# EasyEDA Pro project ProPrj_辉光管时钟V1.0_2025-10-09.epro, schematic 驱动+控制部分

## Sheets
1 驱动: Create Date: 2024-01-20; Page Name: 驱动; Project Name: 辉光管时钟成品; Schematic Name: 驱动+控制部分; Update Date: 2024-01-22; Company: 嘉立创EDA; Page Size: A2; Version: V1.0
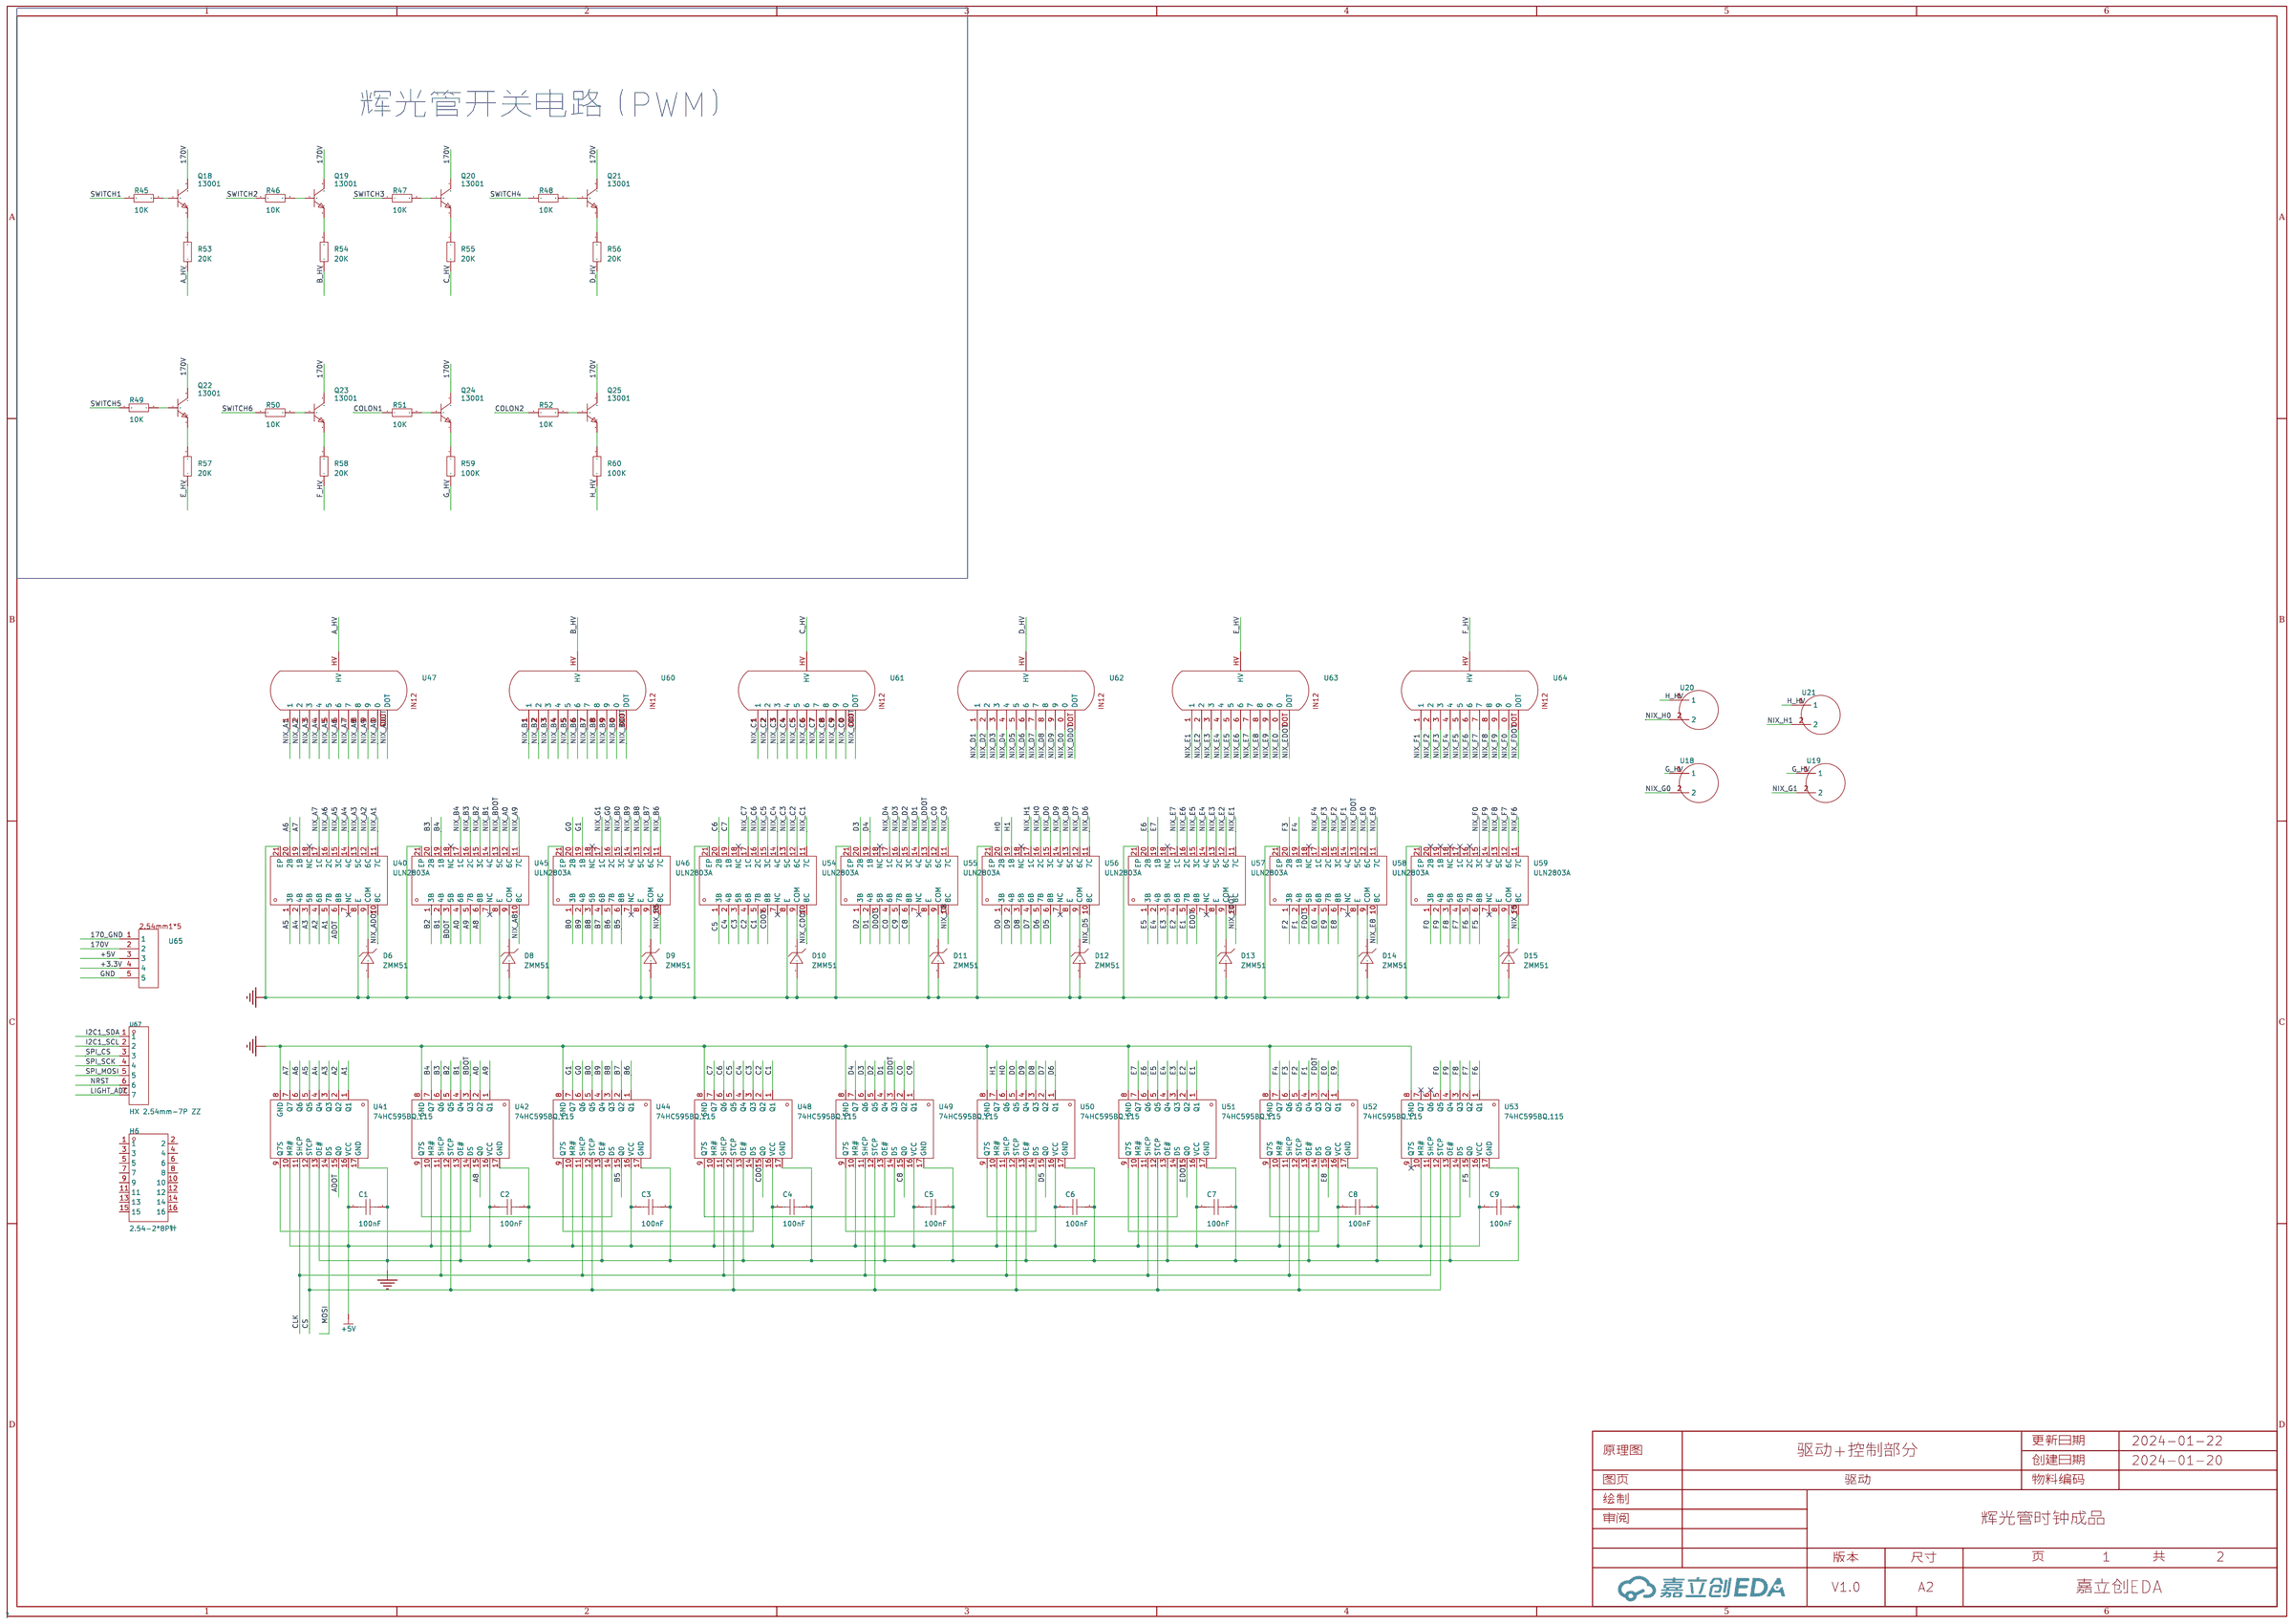
[diagram p4: 驱动]
2 控制: Create Date: 2024-01-22; Page Name: 控制.驱动+控制部分; Page Size: A4
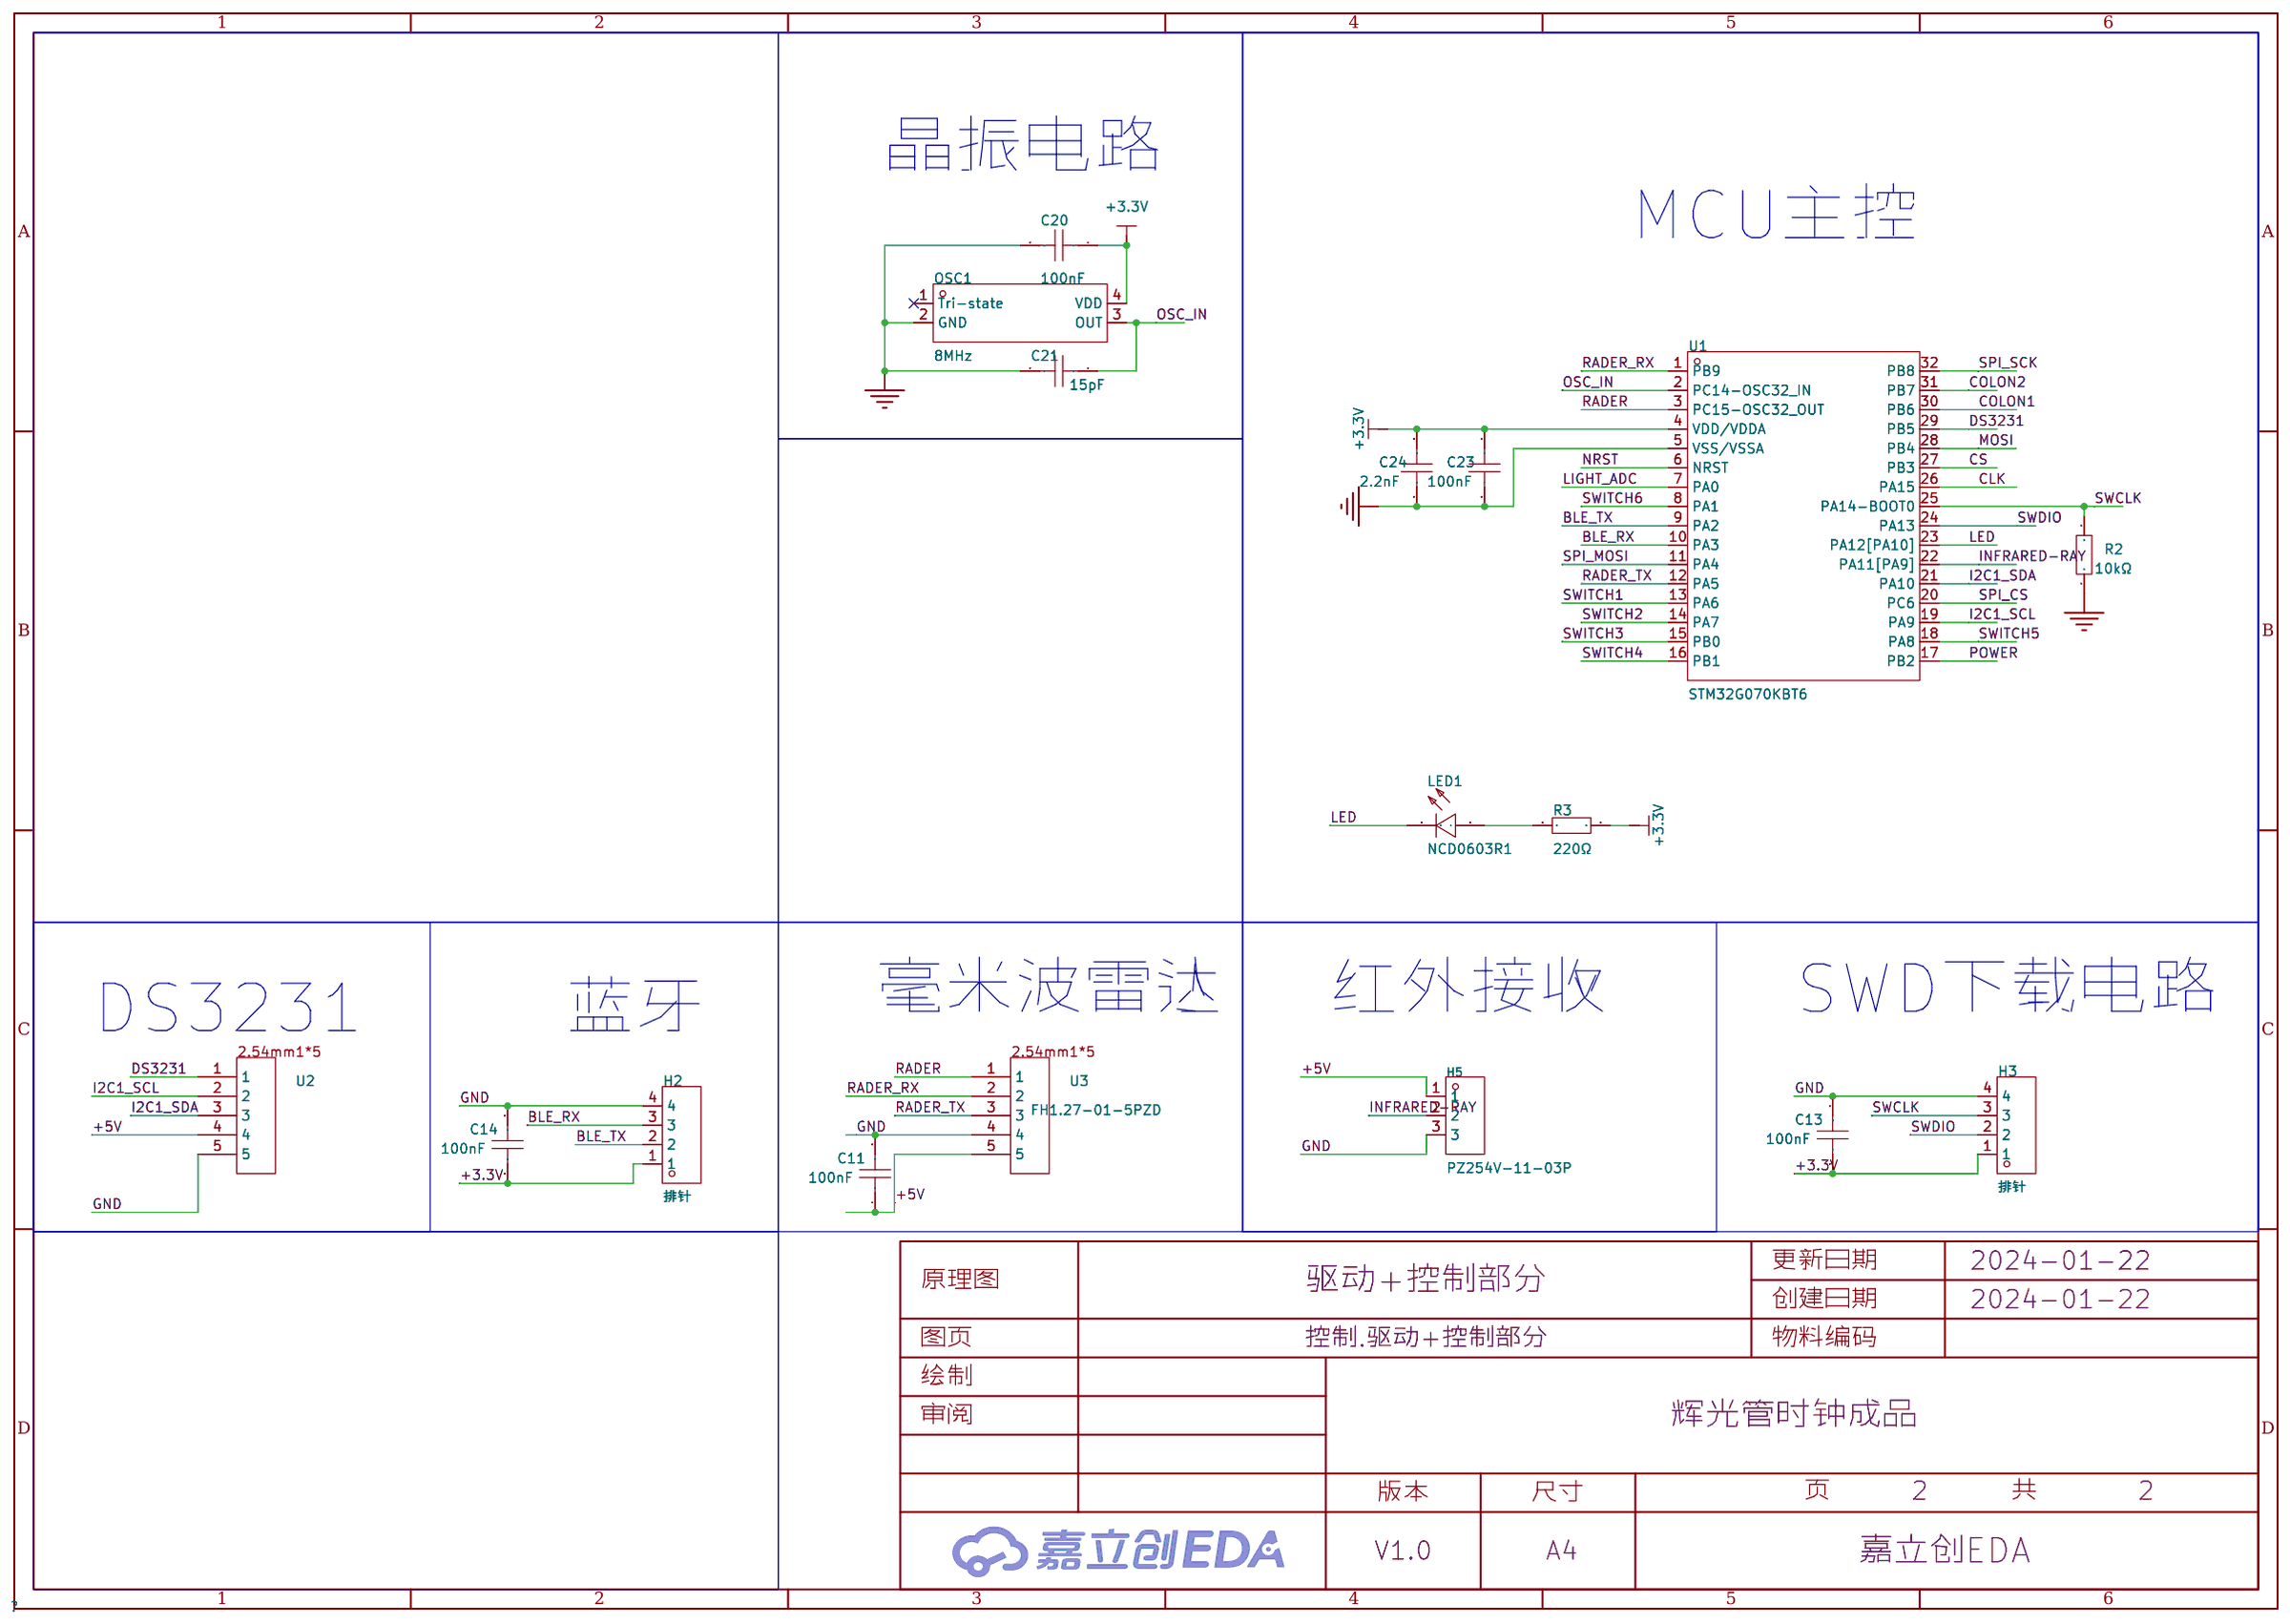
[diagram p5: 控制]

## Parts
sheet 控制
C11  100nF  [C0603]
C13  100nF  [C0603]
C14  100nF  [C0603]
C20  100nF  [C0603]
C21  15pF  [C0603]
C23  100nF  [C0603]
C24  2.2nF  [C0603]
H2  排针  [SIP-2.54MM-4P-CJT-H8.54]
H3  排针  [SIP-2.54MM-4P-CJT-H8.54]
H5  PZ254V-11-03P  [HDR-TH_3P-P2.54-V-M]
LED1  NCD0603R1  [LED0603-RD_RED]
OSC1  8MHz  [OSC-SMD_4P-L3.2-W2.5-BL-1]
R2  10kΩ  [r0603]
R3  220Ω  [r0603]
U1  STM32G070KBT6  [LQFP-32_L7.0-W7.0-P0.80-LS9.0-BL]
U2  -  [2.54mm1*5]
U3  FH1.27-01-5PZD  [HDR-TH_5P-P1.27-V-M]
sheet 驱动
C1  100nF  [C0603]
C2  100nF  [C0603]
C3  100nF  [C0603]
C4  100nF  [C0603]
C5  100nF  [C0603]
C6  100nF  [C0603]
C7  100nF  [C0603]
C8  100nF  [C0603]
C9  100nF  [C0603]
D6  ZMM51  [LL-34_L3.5-W1.5-RD]
D8  ZMM51  [LL-34_L3.5-W1.5-RD]
D9  ZMM51  [LL-34_L3.5-W1.5-RD]
D10  ZMM51  [LL-34_L3.5-W1.5-RD]
D11  ZMM51  [LL-34_L3.5-W1.5-RD]
D12  ZMM51  [LL-34_L3.5-W1.5-RD]
D13  ZMM51  [LL-34_L3.5-W1.5-RD]
D14  ZMM51  [LL-34_L3.5-W1.5-RD]
D15  ZMM51  [LL-34_L3.5-W1.5-RD]
H6  2.54-2*8P针  [HDR-TH_16P-P2.54-V-M-R2-C8-S2.54]
Q18  13001  [SOT-23-3_L2.9-W1.3-P1.90-LS2.4-BR]
Q19  13001  [SOT-23-3_L2.9-W1.3-P1.90-LS2.4-BR]
Q20  13001  [SOT-23-3_L2.9-W1.3-P1.90-LS2.4-BR]
Q21  13001  [SOT-23-3_L2.9-W1.3-P1.90-LS2.4-BR]
Q22  13001  [SOT-23-3_L2.9-W1.3-P1.90-LS2.4-BR]
Q23  13001  [SOT-23-3_L2.9-W1.3-P1.90-LS2.4-BR]
Q24  13001  [SOT-23-3_L2.9-W1.3-P1.90-LS2.4-BR]
Q25  13001  [SOT-23-3_L2.9-W1.3-P1.90-LS2.4-BR]
R45  10K  [R0603]
R46  10K  [R0603]
R47  10K  [R0603]
R48  10K  [R0603]
R49  10K  [R0603]
R50  10K  [R0603]
R51  10K  [R0603]
R52  10K  [R0603]
R53  20K  [R0603]
R54  20K  [R0603]
R55  20K  [R0603]
R56  20K  [R0603]
R57  20K  [R0603]
R58  20K  [R0603]
R59  100K  [R0603]
R60  100K  [R0603]
U18  -  [6*13氖泡]
U19  -  [6*13氖泡]
U20  -  [6*13氖泡]
U21  -  [6*13氖泡]
U40  ULN2803A  [QFN-20_L4.0-W4.0-P0.50-BL-EP]
U41  74HC595BQ,115  [DHVQFN-16_L3.5-W2.5-P0.50-BL-EP]
U42  74HC595BQ,115  [DHVQFN-16_L3.5-W2.5-P0.50-BL-EP]
U44  74HC595BQ,115  [DHVQFN-16_L3.5-W2.5-P0.50-BL-EP]
U45  ULN2803A  [QFN-20_L4.0-W4.0-P0.50-BL-EP]
U46  ULN2803A  [QFN-20_L4.0-W4.0-P0.50-BL-EP]
U47  -  [IN12]
U48  74HC595BQ,115  [DHVQFN-16_L3.5-W2.5-P0.50-BL-EP]
U49  74HC595BQ,115  [DHVQFN-16_L3.5-W2.5-P0.50-BL-EP]
U50  74HC595BQ,115  [DHVQFN-16_L3.5-W2.5-P0.50-BL-EP]
U51  74HC595BQ,115  [DHVQFN-16_L3.5-W2.5-P0.50-BL-EP]
U52  74HC595BQ,115  [DHVQFN-16_L3.5-W2.5-P0.50-BL-EP]
U53  74HC595BQ,115  [DHVQFN-16_L3.5-W2.5-P0.50-BL-EP]
U54  ULN2803A  [QFN-20_L4.0-W4.0-P0.50-BL-EP]
U55  ULN2803A  [QFN-20_L4.0-W4.0-P0.50-BL-EP]
U56  ULN2803A  [QFN-20_L4.0-W4.0-P0.50-BL-EP]
U57  ULN2803A  [QFN-20_L4.0-W4.0-P0.50-BL-EP]
U58  ULN2803A  [QFN-20_L4.0-W4.0-P0.50-BL-EP]
U59  ULN2803A  [QFN-20_L4.0-W4.0-P0.50-BL-EP]
U60  -  [IN12]
U61  -  [IN12]
U62  -  [IN12]
U63  -  [IN12]
U64  -  [IN12]
U65  -  [2.54mm1*5]
U67  HX 2.54mm-7P ZZ  [CONN-TH_7P-P2.50_HX-2.54MM-7P-ZZ]

## Library data of the parts
C11 C13 C14 C20 C21 C23 C24 = CC0603KRX7R9BB104: 容值:100nF;精度:±10%;额定电压:50V;材质(温度系数):X7R;; LCSC Part Name: 100nF ±10% 50V; Supplier Part: C14663; Manufacturer: YAGEO(国巨); Supplier Footprint: 0603; JLCPCB Part Class: Basic Part; Datasheet: https://atta.szlcsc.com/upload/public/pdf/source/20180910/C282072_33301C7F631E79921B82A8DAC6BCC5B3.pdf; Supplier: LCSC; Tolerance: ±10%; Voltage Rated: 50V; Temperature Coefficient: X7R
H2 H3 = 排针
H5 = PZ254V-11-03P: 排数:单排;总PIN位数:3;间距:2.54mm;插针结构:1x3P;行距:-;安装类型:直插;圆针/方针:方针;额定电流:3A;额定电压:250V;配合针长度:6mm;塑高:2.5mm;端接针长度:3mm;工作温度范围:-40℃~+105℃;颜色:黑色;; LCSC Part Name: 2.54mm 1x3P 直插 方针; Supplier Part: C2937625; Manufacturer: XFCN(兴飞); Supplier Footprint: 直插,P=2.54mm; JLCPCB Part Class: Extended Part; Datasheet: 2022-07-12/581362A/62b9d00620994b3696be7eb4af85ad72/双排排针和单排排针.pdf; Supplier: LCSC; Number of Rows: 单排; Number of Pins: 3; Pitch: 2.54mm; Pin Structure: 1x3P; Mounting Type: 直插; Circluar Pins/Square Pins: 方针; Current Rating (Max): 3A; Voltage Rating (Max): 250V; Length of Mating Pin: 6mm; Insulation Height: 2.5mm; Length of End Connection Pin: 3mm; Operating Temperature Range: -40℃~+105℃; Color: 黑色
LED1 = NCD0603R1_C84263: 发光颜色:红色;功率:65mW;透镜颜色:无色透明;主波长:615nm~630nm;发光强度:80mcd~220mcd;发光角度:130°;工作温度:-30℃~+85℃;; LCSC Part Name: 红灯 0603红灯   正贴; Supplier Part: C84263; Manufacturer: 国星光电; Supplier Footprint: 0603; JLCPCB Part Class: 扩展库; Datasheet: https://atta.szlcsc.com/upload/public/pdf/source/20200820/C84263_DABC6A75E58F576973B407FDBA283D60.pdf; Supplier: LCSC; Emitted Color: 红色; Forward Voltage (VF): 1.6V~2.6V; Forward Current: 20mA; Power Dissipation: 65mW; Lens Color: 无色透明; Dominant Wavelength: 615nm~630nm; Luminous Intensity: 80mcd~220mcd; Viewing Angle: 130°; Operating Temperature: -30℃~+85℃
OSC1 = OT2EL4C4JI-111OLP-8M: 频率:8MHz;工作电压:1.8V~3.3V;; LCSC Part Name: 8MHZ?1.8V-3.3V?±10PPM YSO110TR; Supplier Part: C5189450; Manufacturer: YXC(扬兴晶振); Supplier Footprint: SMD3225-4P; JLCPCB Part Class: 扩展库; Datasheet: https://atta.szlcsc.com/upload/public/pdf/source/20221009/1148DEA51132416CC556CBB25766F9C8.pdf; Supplier: LCSC; Supply Voltage: 1.8V~3.3V; Operating Temperature: -40℃~+85℃
R2 R3 = 0805W8F1002T5E_C17414: 电阻类型:厚膜电阻;阻值:10kΩ;精度:±1%;功率:125mW;; LCSC Part Name: 10kΩ ±1% 125mW; Supplier Part: C17414; Manufacturer: UNI-ROYAL(厚声); Manufacturer Part: 0805W8F1002T5E; Supplier Footprint: 0805; JLCPCB Part Class: Basic Part; Datasheet: https://atta.szlcsc.com/upload/public/pdf/source/20200306/C422600_1E6D84923E4A46A82E41ADD87F860B5C.pdf; Supplier: LCSC; Type: 厚膜电阻; Tolerance: ±1%; Power(Watts): 125mW; Temperature Coefficient: ±100ppm/℃; Overload Voltage (Max): 150V; Operating Temperature Range: -55℃~+155℃
U1 = STM32G070KBT6: CPU内核:ARM Cortex-M0;CPU最大主频:64MHz;工作电压范围:2V~3.6V;程序存储容量:128KB;程序存储器类型:FLASH;RAM总容量:36KB;GPIO端口数量:29;; Supplier Part: C529339; Manufacturer: ST(意法半导体); Supplier Footprint: LQFP-32(7x7); JLCPCB Part Class: 扩展库; Datasheet: https://atta.szlcsc.com/upload/public/pdf/source/20200511/C529338_48C8B1D333BC51E6E9668757AAD26A84.pdf; Supplier: LCSC; CPU Core: ARM Cortex-M0; CPU Maximum Speed: 64MHz; Operating Voltage Range: 2V~3.6V; Program Storage Size: 128KB; Program Memory Type: FLASH; RAM Size: 36KB; GPIO Ports Number: 29; ADC (Bit): 12bit; Peripheral/Function: DMA；PWM; Internal Oscillator: 有; Operating Temperature Range: -40℃~+85℃
U2 U65 = 2.54mm1*5
U3 = FH1.27-01-5PZD: 插针结构:1x5P;间距:1.27mm;安装方式:直插;总PIN数:5P;排数:1;每排PIN数:5;额定电流:1A;触头材质:磷青铜;工作温度范围:-40℃~+105℃;; LCSC Part Name: 1x5P 间距:1.27mm 直插; Supplier Part: C7500807; Manufacturer: XUNPU(讯普); Supplier Footprint: 插件,P=1.27mm; Datasheet: https://atta.szlcsc.com/upload/public/pdf/source/20230809/1C0A5A5FA3077CCA4BCC60F929FB990D.pdf; Supplier: LCSC; Pins Structure: 1x5P; Pitch: 1.27mm; Mounting Style: 直插; Number of Pins: 5P; Number of Rows: 1; Number of PINs Per Row: 5; Current Rating (Max): 1A; Contact Material: 磷青铜; Operating Temperature Range: -40℃~+105℃
C1-C9 = CAP_0603: Supplier Footprint: 0603
D6 D8-D15 = ZMM51: 二极管配置:独立式;稳压值(标称值):51V;稳压值(范围):48V~54V;功率:500mW;精度:-;; LCSC Part Name: ZMM51 停产; Supplier Part: C8086; Manufacturer: ST(先科); Supplier Footprint: LL-34; JLCPCB Part Class: Extended Part; Datasheet: https://atta.szlcsc.com/upload/public/pdf/source/20130822/1457706639609.pdf; Supplier: LCSC; Diode Configuration: 独立式; Zener Voltage (Nom): 51V; Reverse Leakage Current (Ir): 100nA@39V; Zener Voltage (Range): 48V~54V; Power Dissipation: 500mW; Zener Impedance (Zzt): 125Ω
H6 = 2.54-2*8P针_C779499: 圆针/方针:-;额定电流:-;额定电压:-;配合针长度:-;塑高:-;触头材质:-;; LCSC Part Name: 双排直插 2*8排针 2.54mm; Supplier Part: C779499; Manufacturer: BOOMELE(博穆精密); Supplier Footprint: 插件,P=2.54mm; JLCPCB Part Class: 扩展库; Datasheet: https://atta.szlcsc.com/upload/public/pdf/source/20221201/C605E3BE9C0F7226363017EFD1BDE852.pdf; Supplier: LCSC
Q18-Q25 = 13001_C2904842: 晶体管类型:NPN;集电极电流(Ic):200mA;集射极击穿电压(Vceo):450V;功率(Pd):625mW;; LCSC Part Name: NPN 电流:200mA 耐压:450V; Supplier Part: C2904842; Manufacturer: YONGYUTAI(永裕泰); Supplier Footprint: SOT-23; JLCPCB Part Class: Extended Part; Datasheet: https://atta.szlcsc.com/upload/public/pdf/source/20211011/662D795392E5FB6F4752F30EDCC66E3B.pdf; Supplier: LCSC; Transistor Type: NPN; Collector Current (Ic): 200mA; Collector-Emitter Breakdown Voltage (Vceo): 450V; Power Dissipation (Pd): 625mW; Transition Frequency (fT): 8MHz; Collector Cut-Off Current (Icbo): 100uA; Collector-Emitter Saturation Voltage (VCE(sat)@Ic,Ib): 400mV@50mA,10mA
R45-R60 = Res_0603: Supplier Footprint: 0603
U18-U21 = 氖泡
U40 U45 U46 U54-U59 = ULN2803A_C493377: 集电极电流(Ic):-;; Supplier Part: C493377; Manufacturer: Mixic(中科芯亿达); Supplier Footprint: QFN-20-EP(4x4); JLCPCB Part Class: Extended Part; Datasheet: https://atta.szlcsc.com/upload/public/pdf/source/20200417/C493377_96E7298976A1714D07CEFF283F4FBF93.pdf; Supplier: LCSC
U41 U42 U44 U48-U53 = 74HC595BQ,115: 功能:-;; Supplier Part: C730243; Manufacturer: Nexperia(安世); Supplier Footprint: DHVQFN-16-EP(2.5x3.5); JLCPCB Part Class: Extended Part; Datasheet: https://atta.szlcsc.com/upload/public/pdf/source/20200702/C547124_A846DA65A930A46F45C6AA18257527FF.pdf; Supplier: LCSC
U47 U60-U64 = IN12
U67 = HX 2.54mm-7P ZZ: 插针结构:1x7P;间距:2.5mm;安装方式:直插;参考系列:XH;总PIN数:7P;排数:1;每排PIN数:7;额定电流:3A;工作温度范围:-25℃~+85℃;; LCSC Part Name: 1x7P 间距:2.5mm 直插 系列:XH; Supplier Part: C7543436; Manufacturer: hanxia(韩下); Supplier Footprint: 插件,P=2.5mm; Datasheet: https://atta.szlcsc.com/upload/public/pdf/source/20230822/B78DEE0721A98B297B9A94E3BAD31844.pdf; Supplier: LCSC; Pins Structure: 1x7P; Pitch: 2.5mm; Mounting Style: 直插; Reference Series: XH; Number of Pins: 7P; Number of Rows: 1; Number of PINs Per Row: 7; Current Rating (Max): 3A; Operating Temperature Range: -25℃~+85℃

## Nets
170V: Q18.3(C) Q19.3(C) Q20.3(C) Q21.3(C) Q22.3(C) Q23.3(C) Q24.3(C) Q25.3(C) U65.2
+3.3V: C13.1 C14.1 C20.1 C23.2 C24.2 H2.1 H3.1 OSC1.4(VDD) R3.1 U1.4(VDD/VDDA) U65.4
+5V: C1.1 C2.1 C3.1 C4.1 C5.1 C6.1 C7.1 C8.1 C9.1 C11.1 H5.1 U2.4 U3.5 U41.10(MR#) U41.16(VCC) U42.10(MR#) U42.16(VCC) U44.10(MR#) U44.16(VCC) U48.10(MR#) U48.16(VCC) U49.10(MR#) U49.16(VCC) U50.10(MR#) U50.16(VCC) U51.10(MR#) U51.16(VCC) U52.10(MR#) U52.16(VCC) U53.10(MR#) U53.16(VCC) U65.3
GND: C1.2 C2.2 C3.2 C4.2 C5.2 C6.2 C7.2 C8.2 C9.2 C11.2 C13.2 C14.2 C20.2 C21.2 C23.1 C24.1 H2.4 H3.4 H5.3 OSC1.2(GND) R2.1 U1.5(VSS/VSSA) U2.5 U3.4 U41.8(GND) U41.13(OE#) U41.17(GND) U42.8(GND) U42.13(OE#) U42.17(GND) U44.8(GND) U44.13(OE#) U44.17(GND) U48.8(GND) U48.13(OE#) U48.17(GND) U49.8(GND) U49.13(OE#) U49.17(GND) U50.8(GND) U50.13(OE#) U50.17(GND) U51.8(GND) U51.13(OE#) U51.17(GND) U52.8(GND) U52.13(OE#) U52.17(GND) U53.8(GND) U53.13(OE#) U53.17(GND) U65.5
170_GND: D6.2(A) D8.2(A) D9.2(A) D10.2(A) D11.2(A) D12.2(A) D13.2(A) D14.2(A) D15.2(A) U40.8(E) U40.21(EP) U45.8(E) U45.21(EP) U46.8(E) U46.21(EP) U54.8(E) U54.21(EP) U55.8(E) U55.21(EP) U56.8(E) U56.21(EP) U57.8(E) U57.21(EP) U58.8(E) U58.21(EP) U59.8(E) U59.21(EP) U65.1
A0: U42.2(Q2) U45.4(6B)
A1: U40.5(7B) U41.1(Q1)
A2: U40.4(6B) U41.2(Q2)
A3: U40.3(5B) U41.3(Q3)
A4: U40.2(4B) U41.4(Q4)
A5: U40.1(3B) U41.5(Q5)
A6: U40.20(2B) U41.6(Q6)
A7: U40.19(1B) U41.7(Q7)
A8: U42.15(Q0) U45.6(8B)
A9: U42.1(Q1) U45.5(7B)
A_HV: R53.1 U47.HV
ADOT: U40.6(8B) U41.15(Q0)
B0: U44.5(Q5) U46.1(3B)
B1: U42.4(Q4) U45.2(4B)
B2: U42.5(Q5) U45.1(3B)
B3: U42.6(Q6) U45.20(2B)
B4: U42.7(Q7) U45.19(1B)
B5: U44.15(Q0) U46.6(8B)
B6: U44.1(Q1) U46.5(7B)
B7: U44.2(Q2) U46.4(6B)
B8: U44.3(Q3) U46.3(5B)
B9: U44.4(Q4) U46.2(4B)
B_HV: R54.1 U60.HV
BDOT: U42.3(Q3) U45.3(5B)
BLE_RX: H2.3 U1.10(PA3)
BLE_TX: H2.2 U1.9(PA2)
C0: U49.2(Q2) U55.4(6B)
C1: U48.1(Q1) U54.5(7B)
C2: U48.2(Q2) U54.4(6B)
C3: U48.3(Q3) U54.3(5B)
C4: U48.4(Q4) U54.2(4B)
C5: U48.5(Q5) U54.1(3B)
C6: U48.6(Q6) U54.20(2B)
C7: U48.7(Q7) U54.19(1B)
C8: U49.15(Q0) U55.6(8B)
C9: U49.1(Q1) U55.5(7B)
C_HV: R55.1 U61.HV
CDOT: U48.15(Q0) U54.6(8B)
CLK: U1.26(PA15) U41.11(SHCP) U42.11(SHCP) U44.11(SHCP) U48.11(SHCP) U49.11(SHCP) U50.11(SHCP) U51.11(SHCP) U52.11(SHCP) U53.11(SHCP)
COLON1: R51.1 U1.30(PB6)
COLON2: R52.1 U1.31(PB7)
CS: U1.27(PB3) U41.12(STCP) U42.12(STCP) U44.12(STCP) U48.12(STCP) U49.12(STCP) U50.12(STCP) U51.12(STCP) U52.12(STCP) U53.12(STCP)
D0: U50.5(Q5) U56.1(3B)
D1: U49.4(Q4) U55.2(4B)
D2: U49.5(Q5) U55.1(3B)
D3: U49.6(Q6) U55.20(2B)
D4: U49.7(Q7) U55.19(1B)
D5: U50.15(Q0) U56.6(8B)
D6: U50.1(Q1) U56.5(7B)
D7: U50.2(Q2) U56.4(6B)
D8: U50.3(Q3) U56.3(5B)
D9: U50.4(Q4) U56.2(4B)
D_HV: R56.1 U62.HV
DDOT: U49.3(Q3) U55.3(5B)
DS3231: U1.29(PB5) U2.1
E0: U52.2(Q2) U58.4(6B)
E1: U51.1(Q1) U57.5(7B)
E2: U51.2(Q2) U57.4(6B)
E3: U51.3(Q3) U57.3(5B)
E4: U51.4(Q4) U57.2(4B)
E5: U51.5(Q5) U57.1(3B)
E6: U51.6(Q6) U57.20(2B)
E7: U51.7(Q7) U57.19(1B)
E8: U52.15(Q0) U58.6(8B)
E9: U52.1(Q1) U58.5(7B)
E_HV: R57.1 U63.HV
EDOT: U51.15(Q0) U57.6(8B)
F0: U53.5(Q5) U59.1(3B)
F1: U52.4(Q4) U58.2(4B)
F2: U52.5(Q5) U58.1(3B)
F3: U52.6(Q6) U58.20(2B)
F4: U52.7(Q7) U58.19(1B)
F5: U53.15(Q0) U59.6(8B)
F6: U53.1(Q1) U59.5(7B)
F7: U53.2(Q2) U59.4(6B)
F8: U53.3(Q3) U59.3(5B)
F9: U53.4(Q4) U59.2(4B)
F_HV: R58.1 U64.HV
FDOT: U52.3(Q3) U58.3(5B)
G0: U44.6(Q6) U46.20(2B)
G1: U44.7(Q7) U46.19(1B)
G_HV: R59.1 U18.1 U19.1
H0: U50.6(Q6) U56.20(2B)
H1: U50.7(Q7) U56.19(1B)
H_HV: R60.1 U20.1 U21.1
I2C1_SCL: U1.19(PA9) U2.2 U67.2
I2C1_SDA: U1.21(PA10) U2.3 U67.1
INFRARED-RAY: H5.2 U1.22(PA11[PA9])
LED: LED1.1(K) U1.23(PA12[PA10])
LIGHT_ADC: U1.7(PA0) U67.7
MOSI: U1.28(PB4) U41.14(DS)
NIX_A0: U45.12(6C) U47.0
NIX_A1: U40.11(7C) U47.1
NIX_A2: U40.12(6C) U47.2
NIX_A3: U40.13(5C) U47.3
NIX_A4: U40.14(4C) U47.4
NIX_A5: U40.15(3C) U47.5
NIX_A6: U40.16(2C) U47.6
NIX_A7: U40.17(1C) U47.7
NIX_A8: U45.10(8C) U47.8
NIX_A9: U45.11(7C) U47.9
NIX_ADOT: U40.10(8C) U47.DOT
NIX_B0: U46.15(3C) U60.0
NIX_B1: U45.14(4C) U60.1
NIX_B2: U45.15(3C) U60.2
NIX_B3: U45.16(2C) U60.3
NIX_B4: U45.17(1C) U60.4
NIX_B5: U46.10(8C) U60.5
NIX_B6: U46.11(7C) U60.6
NIX_B7: U46.12(6C) U60.7
NIX_B8: U46.13(5C) U60.8
NIX_B9: U46.14(4C) U60.9
NIX_BDOT: U45.13(5C) U60.DOT
NIX_C0: U55.12(6C) U61.0
NIX_C1: U54.11(7C) U61.1
NIX_C2: U54.12(6C) U61.2
NIX_C3: U54.13(5C) U61.3
NIX_C4: U54.14(4C) U61.4
NIX_C5: U54.15(3C) U61.5
NIX_C6: U54.16(2C) U61.6
NIX_C7: U54.17(1C) U61.7
NIX_C8: U55.10(8C) U61.8
NIX_C9: U55.11(7C) U61.9
NIX_CDOT: U54.10(8C) U61.DOT
NIX_D0: U56.15(3C) U62.0
NIX_D1: U55.14(4C) U62.1
NIX_D2: U55.15(3C) U62.2
NIX_D3: U55.16(2C) U62.3
NIX_D4: U55.17(1C) U62.4
NIX_D5: U56.10(8C) U62.5
NIX_D6: U56.11(7C) U62.6
NIX_D7: U56.12(6C) U62.7
NIX_D8: U56.13(5C) U62.8
NIX_D9: U56.14(4C) U62.9
NIX_DDOT: U55.13(5C) U62.DOT
NIX_E0: U58.12(6C) U63.0
NIX_E1: U57.11(7C) U63.1
NIX_E2: U57.12(6C) U63.2
NIX_E3: U57.13(5C) U63.3
NIX_E4: U57.14(4C) U63.4
NIX_E5: U57.15(3C) U63.5
NIX_E6: U57.16(2C) U63.6
NIX_E7: U57.17(1C) U63.7
NIX_E8: U58.10(8C) U63.8
NIX_E9: U58.11(7C) U63.9
NIX_EDOT: U57.10(8C) U63.DOT
NIX_F0: U59.15(3C) U64.0
NIX_F1: U58.14(4C) U64.1
NIX_F2: U58.15(3C) U64.2
NIX_F3: U58.16(2C) U64.3
NIX_F4: U58.17(1C) U64.4
NIX_F5: U59.10(8C) U64.5
NIX_F6: U59.11(7C) U64.6
NIX_F7: U59.12(6C) U64.7
NIX_F8: U59.13(5C) U64.8
NIX_F9: U59.14(4C) U64.9
NIX_FDOT: U58.13(5C) U64.DOT
NIX_G0: U18.2 U46.16(2C)
NIX_G1: U19.2 U46.17(1C)
NIX_H0: U20.2 U56.16(2C)
NIX_H1: U21.2 U56.17(1C)
NRST: U1.6(NRST) U67.6
OSC_IN: C21.1 OSC1.3(OUT) U1.2(PC14-OSC32_IN)
POWER: U1.17(PB2)
RADER: U1.3(PC15-OSC32_OUT) U3.1
RADER_RX: U1.1(PB9) U3.2
RADER_TX: U1.12(PA5) U3.3
SPI_CS: U1.20(PC6) U67.3
SPI_MOSI: U1.11(PA4) U67.5
SPI_SCK: U1.32(PB8) U67.4
SWCLK: H3.3 R2.2 U1.25(PA14-BOOT0)
SWDIO: H3.2 U1.24(PA13)
SWITCH1: R45.1 U1.13(PA6)
SWITCH2: R46.1 U1.14(PA7)
SWITCH3: R47.1 U1.15(PB0)
SWITCH4: R48.1 U1.16(PB1)
SWITCH5: R49.1 U1.18(PA8)
SWITCH6: R50.1 U1.8(PA1)
$1N6169: Q18.1(B) R45.2
$1N6235: Q19.1(B) R46.2
$1N6302: Q20.1(B) R47.2
$1N6369: Q21.1(B) R48.2
$1N6436: Q22.1(B) R49.2
$1N6503: Q23.1(B) R50.2
$1N6570: Q24.1(B) R51.2
$1N6637: Q25.1(B) R52.2
$1N6665: Q18.2(E) R53.2
$1N6836: Q19.2(E) R54.2
$1N6839: Q20.2(E) R55.2
$1N6842: Q21.2(E) R56.2
$1N6845: Q25.2(E) R60.2
$1N6848: Q24.2(E) R59.2
$1N6851: Q23.2(E) R58.2
$1N6854: Q22.2(E) R57.2
$1N7281: U41.9(Q7S) U42.14(DS)
$1N7409: U42.9(Q7S) U44.14(DS)
$1N7662: D6.1(C) U40.9(COM)
$1N7759: D8.1(C) U45.9(COM)
$1N7768: D9.1(C) U46.9(COM)
$1N10205: D10.1(C) U54.9(COM)
$1N10207: D11.1(C) U55.9(COM)
$1N10209: D12.1(C) U56.9(COM)
$1N10723: D13.1(C) U57.9(COM)
$1N10725: D14.1(C) U58.9(COM)
$1N10727: D15.1(C) U59.9(COM)
$1N12092: U44.9(Q7S) U48.14(DS)
$1N12107: U48.9(Q7S) U49.14(DS)
$1N12114: U49.9(Q7S) U50.14(DS)
$1N12123: U50.9(Q7S) U51.14(DS)
$1N12132: U51.9(Q7S) U52.14(DS)
$1N12137: U52.9(Q7S) U53.14(DS)
$2N1508: LED1.2(A) R3.2

Not connected (* = marked no-connect by the designer): H6 1 2 3 4 5 6 7 8 9 10 11 12 13 14 15 16; OSC1 1(Tri-state)*; U40 7(NC)* 18(NC)*; U45 7(NC)* 18(NC)*; U46 7(NC)* 18(NC)*; U53 6(Q6)* 7(Q7)* 9(Q7S)*; U54 7(NC)* 18(NC)*; U55 7(NC)* 18(NC)*; U56 7(NC)* 18(NC)*; U57 7(NC)* 18(NC)*; U58 7(NC)* 18(NC)*; U59 7(NC)* 16(2C)* 17(1C)* 18(NC)* 19(1B)* 20(2B)*

## Notes on the sheets
sheet 1
- 辉光管开关电路（PWM）
sheet 2
- 晶振电路
- MCU主控
- 毫米波雷达
- 红外接收
- SWD下载电路
- DS3231
- 蓝牙
